# EAGLE design StyroCutter-556-heatsink-5V (EAGLE 7.2.0)
Styro Cutter PWM controller based on 556
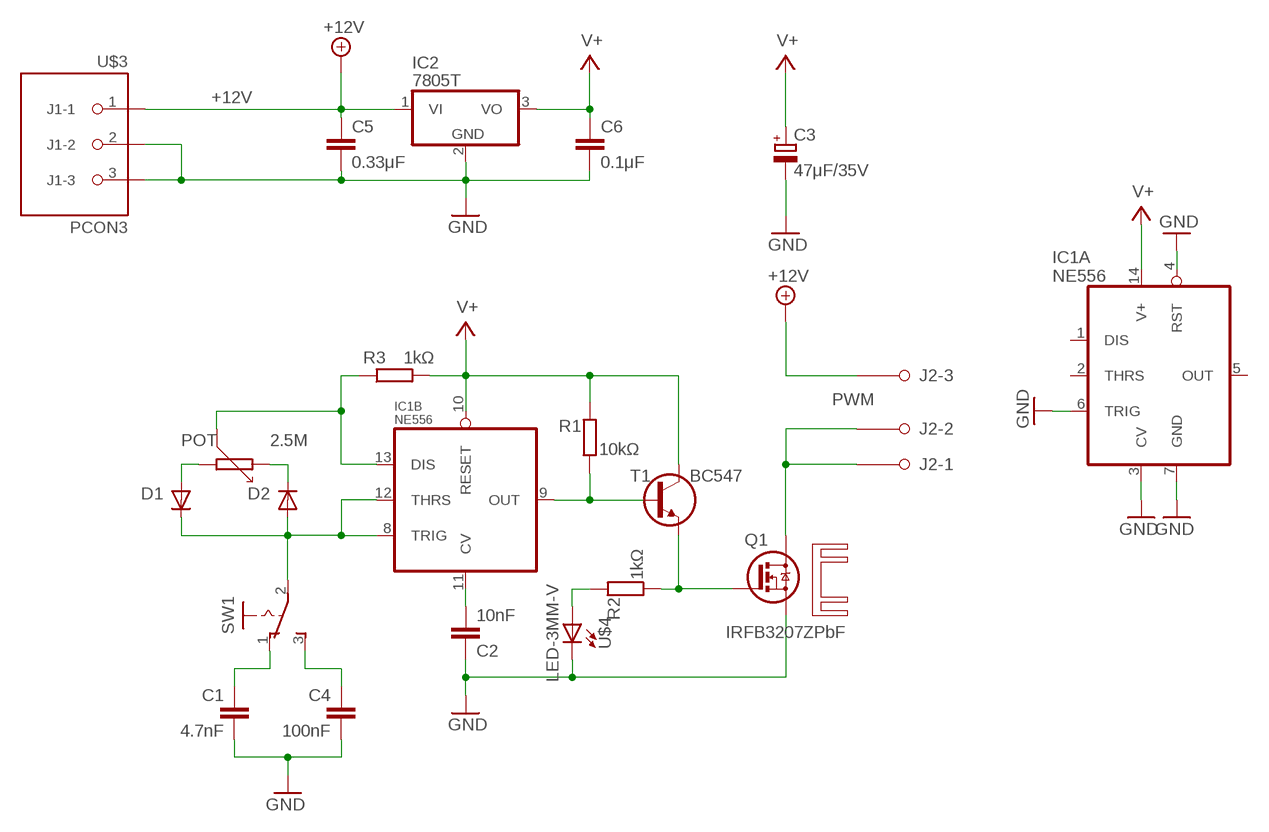
[diagram p0: schematic, sheet 1]

## Parts
C1  4.7nF  C050-020X036  [C050-020X036]
C2  10nF  C050-020X036  [C050-020X036]
C3  47μF/35V  CPOL-EUE2.5-5  [E2,5-5]
C4  100nF  C050-020X036  [C050-020X036]
C5  0.33μF  C050-024X044  [C050-024X044]
C6  0.1μF  C050-024X044  [C050-024X044]
D1  1N4148  1N414834-5  [DO34-5]
D2  1N4148  1N414834-5  [DO34-5]
IC1  NE556  556-ALT-DIL14  [DIL14]
IC2  7805T  [TO220H]
J2  PCON3_MIGROS  [CON-MIGROS-3PIN]
POT  2.5M  PIHER-PT16S  [PC16S]
Q1  IRFB3207ZPbF  PMOSFET_NTO220BV  [TO220BV]
R1  10kΩ  R0204/12  [0204/12]
R2  1kΩ  R0204/10  [0204/10]
R3  1kΩ  R0202/2V  [0202/2V]
SW1  SL-SW-1P-2T  [SLSW-1P2T]
T1  BC547  BC547CBE  [TO92-CBE]
U$2  AQ-SO  [AQ_HS_3A_SO]
U$3  PCON3  [CON-MIGROS-3PIN]
U$4  LED-3MM-V  [LED-3MM-V]

## Nets
+12V: C5.1 IC2.1(VI) J2.3 U$3.1(J1-1)
GND: C1.2 C2.1 C3.- C4.2 C5.2 C6.2 IC1.3(A:CV) IC1.4(A:RST) IC1.6(A:TRIG) IC1.7(A:GND) IC2.2(GND) Q1.S U$3.2(J1-2) U$3.3(J1-3) U$4.C
N$1: D2.C POT.1A
N$2: D1.A POT.1E
N$3: IC1.9(B:OUT) R1.1 T1.B
N$4: C4.1 SW1.3(S)
N$5: C2.2 IC1.11(B:CV)
N$6: IC1.13(B:DIS) POT.1S R3.1
N$7: Q1.G R2.1 T1.E
N$8: D1.C D2.A IC1.8(B:TRIG) IC1.12(B:THRS) SW1.2(P)
N$9: C1.1 SW1.1(O)
N$11: R2.2 U$4.A
PWM: J2.1 J2.2 Q1.D
V+: C3.+ C6.1 IC1.10(B:RESET) IC1.14(A:V+) IC2.3(VO) R1.2 R3.2 T1.C
Unconnected: IC1.1(A:DIS) IC1.2(A:THRS) IC1.5(A:OUT)

## Library data of the parts
C1 C2 C4-C6 = c:C: CAPACITOR, European symbol
C3 = rcl:CPOL-EU: POLARIZED CAPACITOR, European symbol
D1 D2 = d:1N4148
IC1 = ne555-556:*556-ALT
IC2 = linear:78*: Positive VOLTAGE REGULATOR Source: http://cache.national.com/ds/LM/LM78L05.pdf http://www.fairchildsemi.com/ds/LM/LM7805.pdf
J2 = print-conn:PCON3_MIGROS
POT = piher-pt16:PIHER-PT16S
Q1 = power-mosfet:PMOSFET_N: Power MOSFET N-Channel
R1-R3 = r:R: RESISTOR, European symbol
SW1 = sw:SL-SW-1P-2T
T1 = t:BC547
U$2 = heatsink:AQ
U$3 = print-conn:PCON3
U$4 = led:LED

## Net classes
0 GND: width 1.219 mm, clearance 0.635 mm

## Board
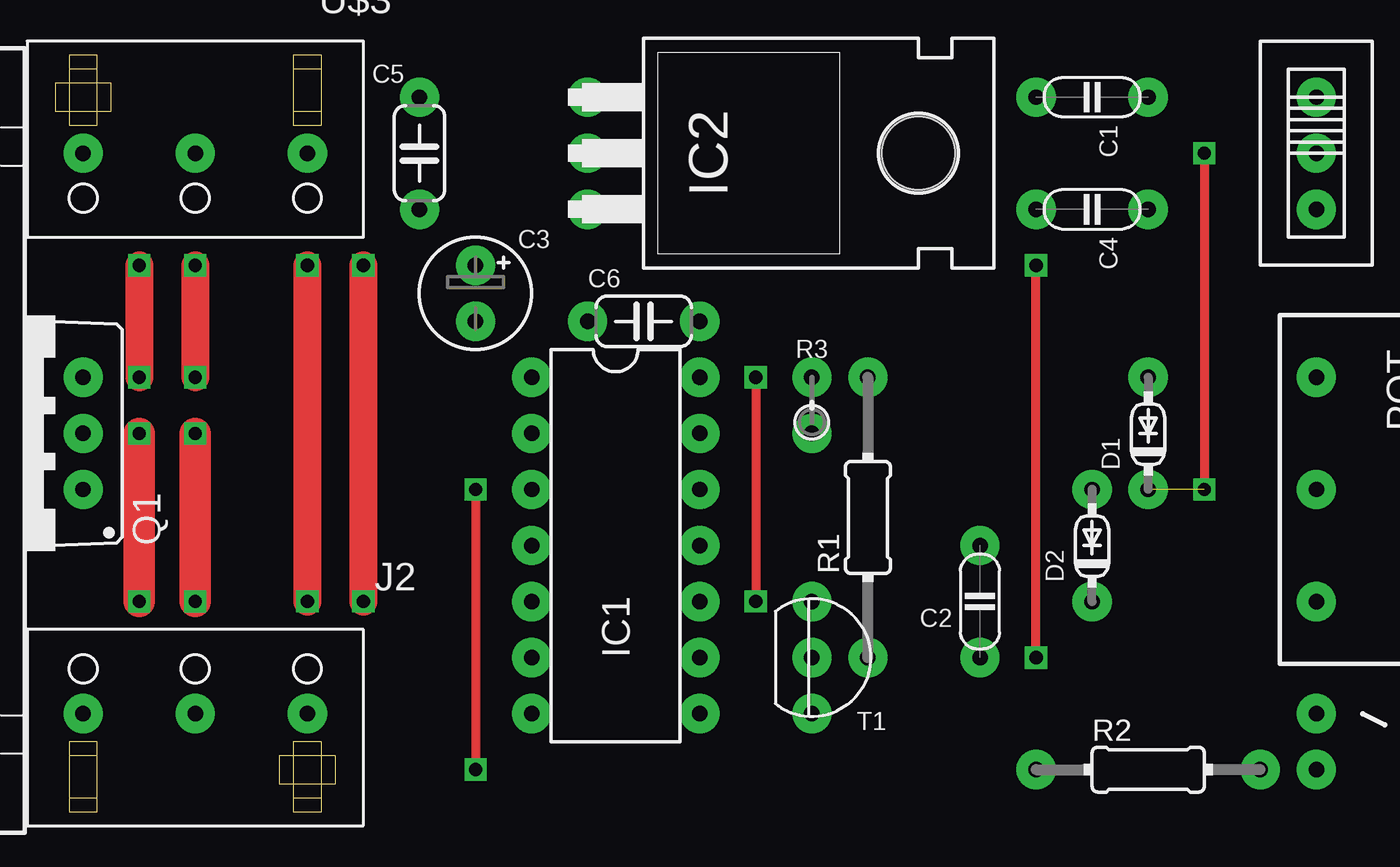
[diagram p1: board, top side]
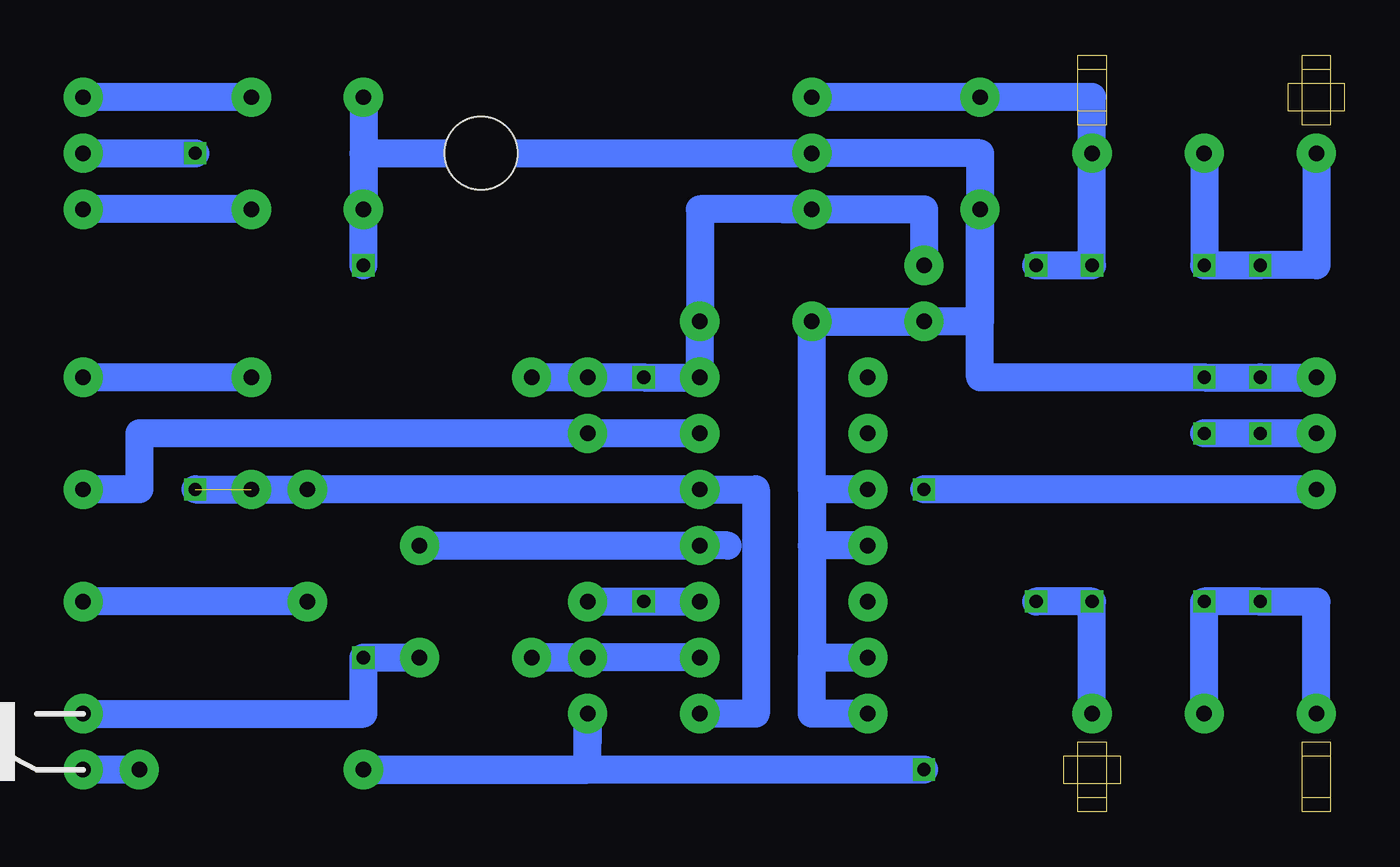
[diagram p2: board, bottom side, seen from below]

Size 12.7 x 34.29 mm. Coordinates in mm from the lower left corner, seen from the top.
Copper layers (1*16): Top 0.035mm / dielectric 1.5mm / Bottom 0.035mm
Design rules "default": minimum track width 10mil, minimum drill 24mil, track to track 8mil, track to pad 8mil, pad to pad 8mil, via to via 8mil, smd to smd 8mil, copper to edge 40mil, drill to drill 8mil, minimum pad ring 10mil, minimum via ring 8mil, stop-mask expansion 4mil, vias tented up to drill 0mil, thermal gap 10mil

### Footprints (pad centres in the part's own frame; a part is rotated, then mirrored left to right if it is on the bottom)
C050-020X036 = drill 0.7 pad 1.778: 1 0,2.54; 2 0,-2.54
E2,5-5 = drill 0.7 pad 1.778: + -1.27,0; - 1.27,0
C050-024X044 = drill 0.7 pad 1.778: 1 -2.54,0; 2 2.54,0
DO34-5 = drill 0.7 pad 1.778: A 2.54,0; C -2.54,0
DIL14 = drill 0.7 pad 1.778: 1 -7.62,-3.81; 2 -5.08,-3.81; 3 -2.54,-3.81; 4 0,-3.81; 5 2.54,-3.81; 6 5.08,-3.81; 7 7.62,-3.81; 8 7.62,3.81; 9 5.08,3.81; 10 2.54,3.81; 11 0,3.81; 12 -2.54,3.81; 13 -5.08,3.81; 14 -7.62,3.81
TO220H = drill 0.7 pad 1.778: 1 -2.54,-10.16; 2 0,-10.16; 3 2.54,-10.16 | hole 3.302: 0,4.826
CON-MIGROS-3PIN = drill 0.7 pad 1.778: 1 -5.08,0; 2 0,0; 3 5.08,0
PC16S = drill 0.7 pad 1.778: 1A -5.08,2.54; 1E 5.08,2.54; 1S 0,2.54
TO220BV = drill 0.7 pad 1.778: D 0,-2.54; G -2.54,-2.54; S 2.54,-2.54
0204/12 = drill 0.7 pad 1.778: 1 -6.35,0; 2 6.35,0
0204/10 = drill 0.7 pad 1.778: 1 -5.08,0; 2 5.08,0
0202/2V = drill 0.7 pad 1.778: 1 0,-1.27; 2 0,1.27
SLSW-1P2T = drill 0.7 pad 1.778: 1 0,2.54; 2 0,0; 3 0,-2.54
TO92-CBE = drill 0.7 pad 1.778: B 0,0; C -2.54,0; E 2.54,0
LED-3MM-V = drill 0.7 pad 1.778: A 0,1.27; C 0,-1.27

### Placement (x,y rotation side)
C1  46.99,32.39 270 top  (outside the outline)
C2  41.91,9.52 180 top  (outside the outline)
C3  19.05,23.49 270 top  (outside the outline)
C4  46.99,27.3 270 top  (outside the outline)
C5  16.51,29.84 270 top  (outside the outline)
C6  26.67,22.22 180 top  (outside the outline)
D1  49.53,17.14 90 top  (outside the outline)
D2  46.99,12.06 90 top  (outside the outline)
IC1  25.4,12.06 270 top  (outside the outline)
IC2  34.29,29.84 270 top  (outside the outline)
J2  6.35,4.44 0 top
POT  59.69,14.61 90 top  (outside the outline)
Q1  -1.27,17.14 90 top
R1  36.83,13.34 90 top  (outside the outline)
R2  49.53,1.9 0 top  (outside the outline)
R3  34.29,18.41 0 top  (outside the outline)
SW1  57.15,29.84 0 top  (outside the outline)
T1  34.29,6.98 270 top  (outside the outline)
U$2  -3.81,17.14 90 top  (outside the outline)
U$3  6.35,29.84 180 top
U$4  57.15,3.17 180 bottom  (outside the outline)

### Tracks (layer width: path | path; a pad name or v marks a point on that pad's centre or on a via)
+12V  (via drill 0.6)
  Top 1.27: v11.43,9.52 v11.43,24.76 | v13.97,9.52 v13.97,24.76
  Bottom 1.27: IC2.1 C5.1 11.43,32.39 U$3.1 v11.43,24.76 v13.97,24.76 | J2.3 v11.43,9.52 v13.97,9.52
GND  (via drill 0.6)
  Top 0.406: v44.45,6.98 v44.45,24.76
  Top 1.27: v6.35,24.76 v6.35,19.68 | v3.81,24.76 v3.81,19.68
  Bottom 1.27: C1.2 44.45,29.84 | 44.45,29.84 IC2.2 16.51,29.84 C5.2 | U$3.2 v6.35,24.76 v3.81,24.76 1.27,24.76 U$3.3 | Q1.S v3.81,19.68 v6.35,19.68 16.51,19.68 C5.2 | U$4.C 44.45,4.44 v44.45,6.98 C2.1 | 24.13,14.61 C6.2 C3.- 16.51,22.22 C5.2 | IC1.3 24.13,14.61 | 24.13,14.61 24.13,12.06 | IC1.4 24.13,12.06 | 24.13,12.06 24.13,6.98 | 24.13,6.98 IC1.6 | IC1.7 24.13,4.44 24.13,6.98 | v44.45,24.76 C4.2 44.45,29.84
N$1
  Bottom 1.27: D2.C POT.1A
N$2
  Bottom 1.27: D1.A POT.1E
N$3
  Bottom 1.27: IC1.9 R1.1 T1.B
N$4
  Bottom 1.27: C4.1 SW1.3
N$5
  Bottom 1.27: C2.2 IC1.11 27.94,12.06
N$6
  Bottom 1.27: POT.1S 54.61,14.61 54.61,17.14 R3.1 IC1.13
N$7  (via drill 0.6)
  Top 0.406: v19.05,14.61 v19.05,1.9
  Bottom 1.27: Q1.G v19.05,14.61 | v19.05,1.9 R2.1 34.29,1.9 34.29,3.17 | 34.29,3.17 T1.E | T1.E | T1.E | T1.E | T1.E 34.29,3.17
N$8  (via drill 0.6)  (1 unrouted)
  Top 0.406: v52.07,29.84 v52.07,14.61
  Bottom 1.27: IC1.8 26.67,4.44 26.67,14.61 IC1.12 D2.A v52.07,14.61 | SW1.2 v52.07,29.84
N$9
  Bottom 1.27: C1.1 SW1.1
N$11
  Bottom 1.27: R2.2 U$4.A
PWM  (via drill 0.6)
  Top 1.422: v6.35,17.14 v6.35,9.52 | v3.81,17.14 v3.81,9.52
  Bottom 1.27: Q1.D v6.35,17.14 | J2.2 v6.35,9.52 v3.81,9.52 1.27,9.52 J2.1
V+  (via drill 0.6)
  Top 0.406: v31.75,19.68 v31.75,9.52
  Bottom 1.27: 25.4,27.3 IC2.3 | IC2.3 29.21,27.3 C6.1 IC1.14 v31.75,19.68 | T1.C v31.75,9.52 IC1.10 | v31.75,19.68 R1.2 | v31.75,19.68 R3.2 | IC2.3 19.05,27.3 C3.+

### Text on the board
Document: IN- | IN+ | OUT- | OUT+